# Altium schematic sheet dcb_top.SchDoc
size A4; SheetNumber: 1; SheetTotal: 8
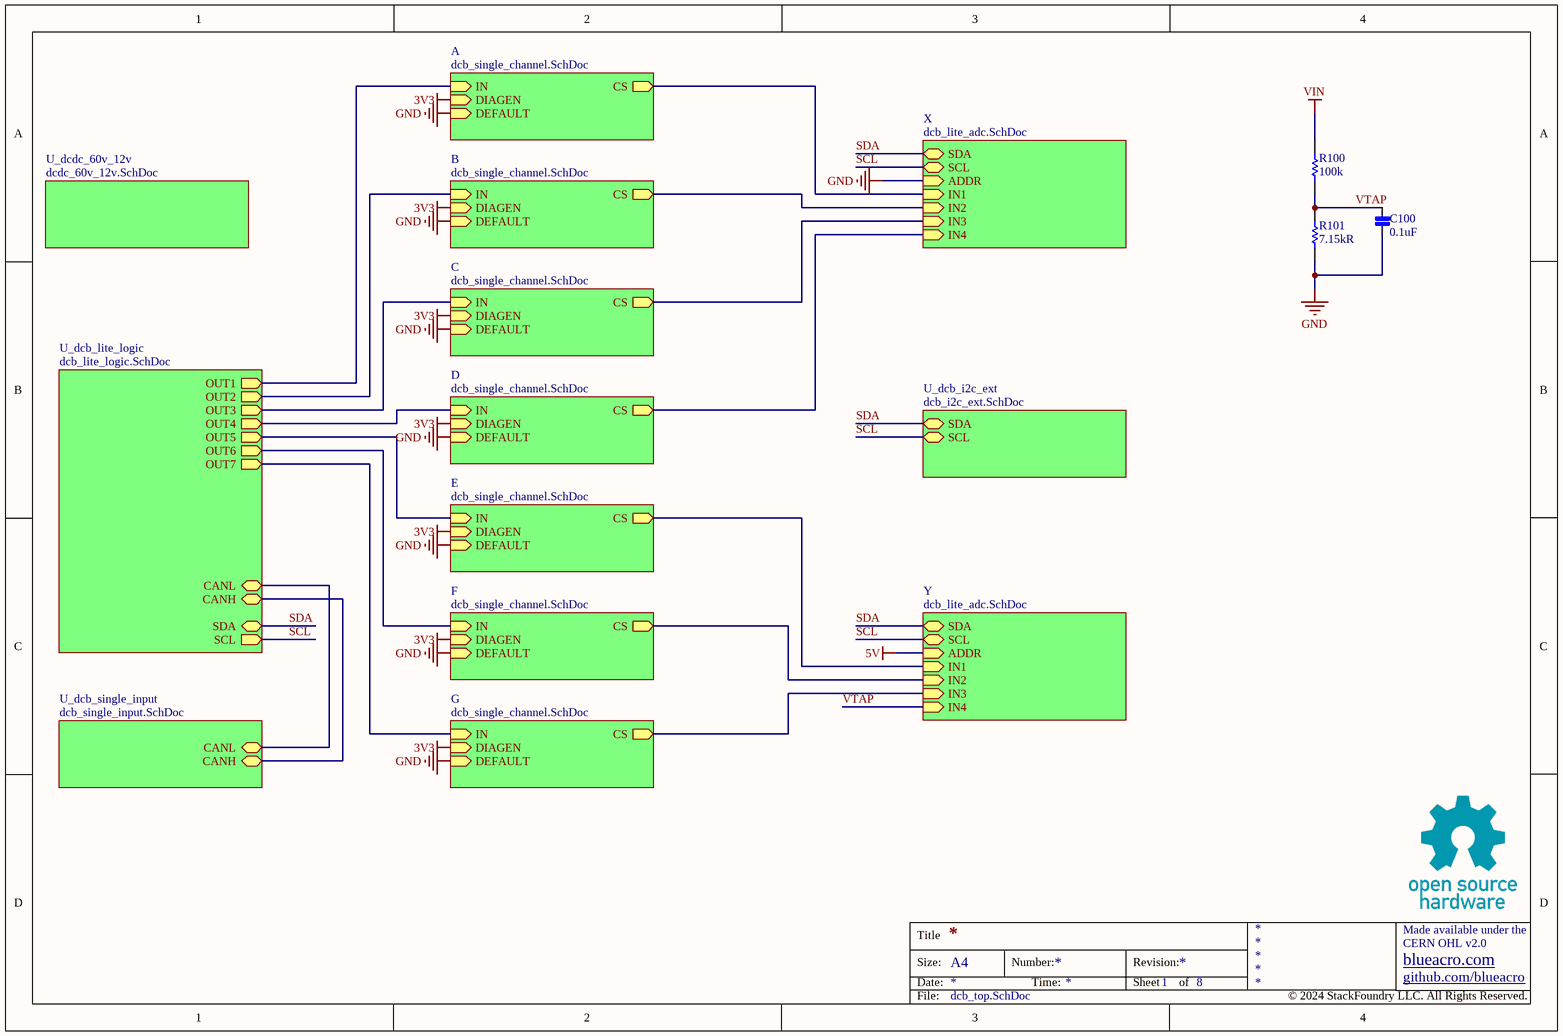
[diagram p0: dcb_top.SchDoc]

## Parts
C100  value 0.1uF  [FP-CL10-IPC_B]  (hidden comment: CAP 0.1uF 50V X7R 0603)
R100  value 100k  [RESC1608-IPC-LL]  (hidden comment: 100k 0603 1%)
R101  value 7.15kR  [RESC1608X55X30NL20T20]  (hidden comment: 7.15k 0603 0.1%)

## Sub-sheets
A = dcb_single_channel.SchDoc: IN (in), DIAGEN (in), CS (out), DEFAULT (in)
B = dcb_single_channel.SchDoc: IN (in), DIAGEN (in), CS (out), DEFAULT (in)
C = dcb_single_channel.SchDoc: IN (in), DIAGEN (in), CS (out), DEFAULT (in)
D = dcb_single_channel.SchDoc: IN (in), DIAGEN (in), CS (out), DEFAULT (in)
E = dcb_single_channel.SchDoc: IN (in), DIAGEN (in), CS (out), DEFAULT (in)
F = dcb_single_channel.SchDoc: IN (in), DIAGEN (in), CS (out), DEFAULT (in)
G = dcb_single_channel.SchDoc: IN (in), DIAGEN (in), CS (out), DEFAULT (in)
U_dcb_i2c_ext = dcb_i2c_ext.SchDoc: SDA (bidir), SCL (bidir)
U_dcb_lite_logic = dcb_lite_logic.SchDoc: OUT1 (out), OUT2 (out), OUT3 (out), OUT4 (out), OUT5 (out), OUT6 (out), OUT7 (out), SDA (bidir), SCL (out), CANL (bidir), CANH (bidir)
U_dcb_single_input = dcb_single_input.SchDoc: CANH (bidir), CANL (bidir)
U_dcdc_60v_12v = dcdc_60v_12v.SchDoc: no entries
X = dcb_lite_adc.SchDoc: SDA (bidir), SCL (bidir), ADDR (in), IN1 (in), IN2 (in), IN3 (in), IN4 (in)
Y = dcb_lite_adc.SchDoc: SDA (bidir), SCL (bidir), ADDR (in), IN1 (in), IN2 (in), IN3 (in), IN4 (in)

## Nets
3V3: sheet A/DIAGEN, sheet B/DIAGEN, sheet C/DIAGEN, sheet D/DIAGEN, sheet E/DIAGEN, sheet F/DIAGEN, sheet G/DIAGEN
5V: sheet Y/ADDR
GND: C100.2 R101.1 ; sheet A/DEFAULT, sheet B/DEFAULT, sheet C/DEFAULT, sheet D/DEFAULT, sheet E/DEFAULT, sheet F/DEFAULT, sheet G/DEFAULT, sheet X/ADDR
VIN: R100.2
SCL: sheet U_dcb_lite_logic/SCL, sheet X/SCL, sheet Y/SCL, sheet U_dcb_i2c_ext/SCL
SDA: sheet U_dcb_lite_logic/SDA, sheet X/SDA, sheet Y/SDA, sheet U_dcb_i2c_ext/SDA
VTAP: C100.1 R100.1 R101.2 ; sheet Y/IN4
(unnamed): sheet A/IN, sheet U_dcb_lite_logic/OUT1
(unnamed): sheet A/CS, sheet X/IN1
(unnamed): sheet B/IN, sheet U_dcb_lite_logic/OUT2
(unnamed): sheet B/CS, sheet X/IN2
(unnamed): sheet C/IN, sheet U_dcb_lite_logic/OUT3
(unnamed): sheet C/CS, sheet X/IN3
(unnamed): sheet D/IN, sheet U_dcb_lite_logic/OUT4
(unnamed): sheet D/CS, sheet X/IN4
(unnamed): sheet E/IN, sheet U_dcb_lite_logic/OUT5
(unnamed): sheet E/CS, sheet Y/IN1
(unnamed): sheet F/IN, sheet U_dcb_lite_logic/OUT6
(unnamed): sheet F/CS, sheet Y/IN2
(unnamed): sheet G/IN, sheet U_dcb_lite_logic/OUT7
(unnamed): sheet G/CS, sheet Y/IN3
(unnamed): sheet U_dcb_lite_logic/CANL, sheet U_dcb_single_input/CANL
(unnamed): sheet U_dcb_lite_logic/CANH, sheet U_dcb_single_input/CANH

## Notes on the sheet
- Title
- Size:
- Date:
- A4
- Number:
- Time:
- Revision:
- Sheet
- of
- github.com/blueacro
- blueacro.com
- CERN OHL v2.0
- Made available under the
- File:
- © 2024 StackFoundry LLC. All Rights Reserved.

## Library data of the parts
C100 = CMP-001-00084-7: Cap Ceramic 0.1uF 50V X7R 20% SMD 0603 125C Paper T/R; Voltage: 50V
R100 = CMP-009-00222-1: SMD Chip Resistor, 100 kOhm, ± 1%, 100 mW, 0603 [1608 Metric], Thick Film, General Purpose; Voltage Rating: 50V; Case Code (Metric): 1608; Height: 0.45mm; Tolerance: 1%; Width: 0.8mm; Resistance Tolerance: 1%; Case/Package: 0603; Case Code (Imperial): 0603
R101 = CMP-009-00235-1: Res Thin Film 0603 7.15K Ohm 0.1% 1/10W ±25ppm/°C Molded SMD SMD Punched Carrier T/R; Voltage Rating: 75V; Power Rating: 100mW; Number of Terminations: 2; Temperature Coefficient: 25ppm/°C; Weight: 7.1E-05oz; Technology: METAL FILM; Contact Plating: Tin; Features: Automotive AEC-Q200; Height: 0.45mm; Termination: SMD/SMT; Case Code (Imperial): 0603; Pins: 2; Case Code (Metric): 1608; Depth: 0.8mm; Mounting Technology: Surface Mount; Reach SVHC Compliant: No; Packaging: Tape and Reel; Width: 0.8mm; Resistance Tolerance: 0.1%; Resistor Type: Thin Film; Min Operating Temperature: -55°C; Series: ERA; Ratings: AEC-Q200; RoHS Compliant: Yes; Case/Package: 0603; Length: 1.6mm; Package Quantity: 1; Voltage Rating (DC): 75V; Lead Free: Lead Free; Max Operating Temperature: 155°C; Max Power Dissipation: 100mW